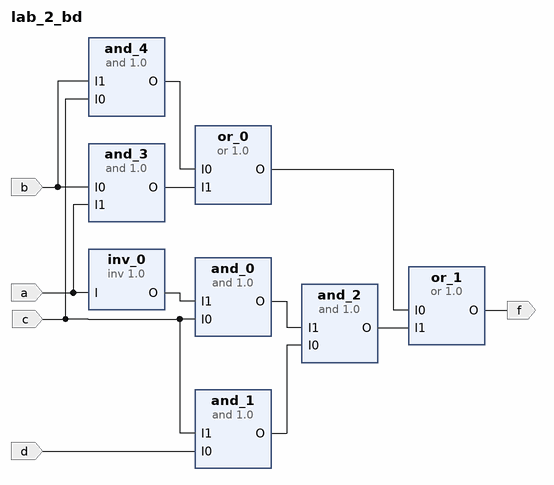
[diagram p0: block diagram of the top level]
# Vivado block design lab_2_bd, xc7a35tcpg236-1, Vivado 2018.3
create_bd_design lab_2_bd

create_bd_port -dir I a
create_bd_port -dir I -type data c
create_bd_port -dir I -type data d
create_bd_port -dir I -type data b
create_bd_port -dir O -type data f

create_bd_cell -type ip -vlnv FIT:user:inv:1.0 inv_0
create_bd_cell -type ip -vlnv FIT:user:and:1.0 and_0
create_bd_cell -type ip -vlnv FIT:user:and:1.0 and_1
create_bd_cell -type ip -vlnv FIT:user:and:1.0 and_2
create_bd_cell -type ip -vlnv FIT:user:and:1.0 and_3
create_bd_cell -type ip -vlnv FIT:user:and:1.0 and_4
create_bd_cell -type ip -vlnv FIT:user:or:1.0 or_0
create_bd_cell -type ip -vlnv FIT:user:or:1.0 or_1

# ---- connections ----

connect_bd_net -net I_0_1 [get_bd_ports a] [get_bd_pins inv_0/I] [get_bd_pins and_3/I1]
connect_bd_net [get_bd_pins inv_0/O] [get_bd_pins and_0/I1]
connect_bd_net -net I0_0_1 [get_bd_ports c] [get_bd_pins and_0/I0] [get_bd_pins and_1/I1] [get_bd_pins and_4/I0]
connect_bd_net -net I0_0_2 [get_bd_ports d] [get_bd_pins and_1/I0]
connect_bd_net [get_bd_pins and_0/O] [get_bd_pins and_2/I1]
connect_bd_net [get_bd_pins and_1/O] [get_bd_pins and_2/I0]
connect_bd_net -net I0_0_3 [get_bd_ports b] [get_bd_pins and_3/I0] [get_bd_pins and_4/I1]
connect_bd_net [get_bd_pins and_4/O] [get_bd_pins or_0/I0]
connect_bd_net [get_bd_pins and_3/O] [get_bd_pins or_0/I1]
connect_bd_net [get_bd_pins or_0/O] [get_bd_pins or_1/I0]
connect_bd_net [get_bd_pins and_2/O] [get_bd_pins or_1/I1]
connect_bd_net [get_bd_pins or_1/O] [get_bd_ports f]

validate_bd_design
save_bd_design
